# Altium schematic sheet v1.0.SchDoc
size 71 x 58 mm
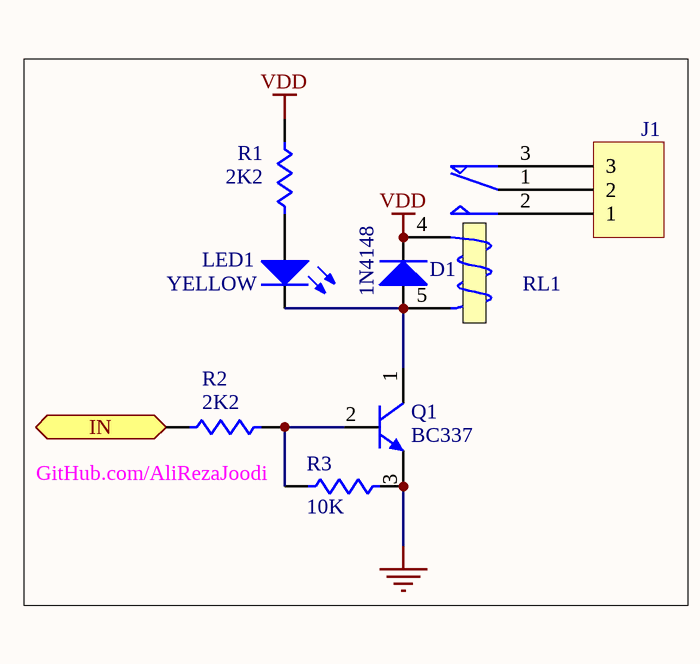
[diagram p0: v1.0.SchDoc]

## Parts
D1  1N4148  [DIODE0.4_Glass]
J1  3PIN  [Fonics_3PIN_1]  (value not drawn)
LED1  YELLOW  [LED_5mm]
Q1  BC337  [TO92C]
R1  2K2  [AXIAL-0.4]
R2  2K2  [AXIAL-0.4]
R3  10K  [AXIAL-0.4]
RL1  12V  [RELAY-SPDT-1]  (value not drawn)

## Ports
IN (in)

## Nets
GND: Q1.3(E) R3.1
VDD: D1.2(K) R1.1 RL1.4(T1)
IN: R2.2 ; port IN
NetD1_1: D1.1(A) LED1.2(K) Q1.1(C) RL1.5(T2)
NetJ1_1: J1.1 RL1.2(NO)
NetJ1_2: J1.2 RL1.1(COM)
NetJ1_3: J1.3 RL1.3(NC)
NetLED1_1: LED1.1(A) R1.2
NetQ1_2: Q1.2(B) R2.1 R3.2

## Notes on the sheet
- GitHub.com/AliRezaJoodi

## Library data of the parts
D1 = Diode: Default Diode; Manufacturer: Generic Components; Class I: Discrete; Class II: Diode - Switching; Published: 8-Jun-2000; Revision: July-2002: Re-released for DXP Platform.; Publisher: Altium Limited
J1 = Header 3: Header, 3-Pin; Manufacturer: Generic Components; Class I: Connector; Revision: July-2002: Re-released for DXP Platform.; Publisher: Altium Limited
LED1 = Optical Transmitter: Typical INFRARED GaAs LED; Manufacturer: Generic Components; Class I: Optoelectronic; Published: 8-Jun-2000; Revision: July-2002: Re-released for DXP Platform.; Publisher: Altium Limited; Class II: LED
Q1 = NPN: NPN Bipolar Transistor; Manufacturer: Generic Components; Class I: Discrete; Class II: BJT - Low Power; Published: 8-Jun-2000; Revision: July-2002: Re-released for DXP Platform.; Publisher: Altium Limited
R1-R3 = Res1: Resistor; Manufacturer: Generic Components; Class I: Passive; Published: 8-Jun-2000; Revision: July-2002: Re-released for DXP Platform.; Publisher: Altium Limited; Class II: Resistor
RL1 = Relay-SPDT_2: SPDT Relay; Manufacturer: Generic Components; Class I: Electro-mechanical; Published: 8-Jun-2000; Revision: July-2002: Re-released for DXP Platform.; Publisher: Altium Limited; Class II: Relay